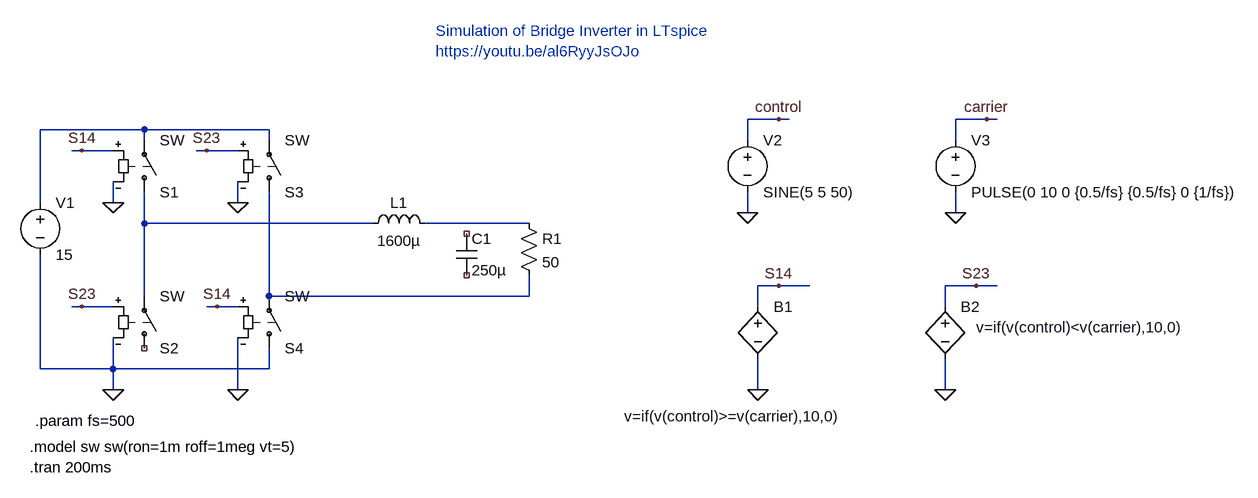
[diagram p0: schematic DC-to-AC-bipolar-full-bridge.asc]
DC-to-AC-bipolar-full-bridge.asc, the LTspice schematic file:
Version 4
SHEET 1 1936 680
WIRE 1152 0 1104 0
WIRE 1168 0 1152 0
WIRE 1472 0 1424 0
WIRE 1488 0 1472 0
WIRE 176 16 16 16
WIRE 368 16 176 16
WIRE 176 32 176 16
WIRE 368 32 368 16
WIRE 1104 32 1104 0
WIRE 1424 32 1424 0
WIRE 80 48 64 48
WIRE 128 48 80 48
WIRE 272 48 256 48
WIRE 320 48 272 48
WIRE 16 128 16 16
WIRE 128 128 128 96
WIRE 320 128 320 96
WIRE 1104 144 1104 112
WIRE 1424 144 1424 112
WIRE 176 160 176 112
WIRE 528 160 176 160
WIRE 768 160 608 160
WIRE 1152 256 1120 256
WIRE 1200 256 1152 256
WIRE 1456 256 1408 256
WIRE 1488 256 1456 256
WIRE 176 272 176 160
WIRE 368 272 368 112
WIRE 768 272 768 240
WIRE 768 272 368 272
WIRE 80 288 64 288
WIRE 128 288 80 288
WIRE 288 288 272 288
WIRE 320 288 288 288
WIRE 1120 288 1120 256
WIRE 1408 288 1408 256
WIRE 16 384 16 208
WIRE 128 384 128 336
WIRE 128 384 16 384
WIRE 368 384 368 352
WIRE 368 384 128 384
WIRE 128 416 128 384
WIRE 320 416 320 336
WIRE 1120 416 1120 368
WIRE 1408 416 1408 368
FLAG 320 128 0
FLAG 128 128 0
FLAG 128 416 0
FLAG 320 416 0
FLAG 80 48 S14
FLAG 288 288 S14
FLAG 272 48 S23
FLAG 80 288 S23
FLAG 1104 144 0
FLAG 1424 144 0
FLAG 1152 0 control
FLAG 1472 0 carrier
FLAG 1120 416 0
FLAG 1408 416 0
FLAG 1152 256 S14
FLAG 1456 256 S23
SYMBOL voltage 16 112 R0
WINDOW 123 0 0 Left 0
WINDOW 39 0 0 Left 0
SYMATTR InstName V1
SYMATTR Value 15
SYMBOL sw 176 128 M180
SYMATTR InstName S1
SYMBOL sw 176 368 M180
SYMATTR InstName S2
SYMBOL sw 368 128 M180
SYMATTR InstName S3
SYMBOL sw 368 368 M180
SYMATTR InstName S4
SYMBOL ind 512 176 R270
WINDOW 0 32 56 VTop 2
WINDOW 3 5 56 VBottom 2
SYMATTR InstName L1
SYMATTR Value 1600µ
SYMATTR SpiceLine Rser=200m
SYMBOL cap 656 176 R0
SYMATTR InstName C1
SYMATTR Value 250µ
SYMATTR SpiceLine Rser=100m
SYMBOL res 752 144 R0
SYMATTR InstName R1
SYMATTR Value 50
SYMBOL voltage 1104 16 R0
WINDOW 123 0 0 Left 0
WINDOW 39 0 0 Left 0
SYMATTR InstName V2
SYMATTR Value SINE(5 5 50)
SYMBOL voltage 1424 16 R0
WINDOW 123 0 0 Left 0
WINDOW 39 0 0 Left 0
SYMATTR InstName V3
SYMATTR Value PULSE(0 10 0 {0.5/fs} {0.5/fs} 0 {1/fs})
SYMBOL bv 1120 272 R0
WINDOW 3 -206 185 Left 2
SYMATTR Value v=if(v(control)>=v(carrier),10,0)
SYMATTR InstName B1
SYMBOL bv 1408 272 R0
WINDOW 3 48 48 Left 2
SYMATTR Value v=if(v(control)<v(carrier),10,0)
SYMATTR InstName B2
TEXT 8 464 Left 2 !.param fs=500
TEXT 0 504 Left 2 !.model sw sw(ron=1m roff=1meg vt=5)\n.tran 200ms
TEXT 624 -136 Left 2 ;Simulation of Bridge Inverter in LTspice\nhttps://youtu.be/al6RyyJsOJo

The netlist it stands for:
* DC-to-AC-bipolar-full-bridge.asc
V1 N001 0 15
S1 N002 N001 S14 0 SW
S2 NC_01 N002 S23 0 SW
S3 N004 N001 S23 0 SW
S4 0 N004 S14 0 SW
L1 N002 N003 1600µ Rser=200m
C1 NC_02 NC_03 250µ Rser=100m
R1 N003 N004 50
V2 control 0 SINE(5 5 50)
V3 carrier 0 PULSE(0 10 0 {0.5/fs} {0.5/fs} 0 {1/fs})
B1 S14 0 v=if(v(control)>=v(carrier),10,0)
B2 S23 0 v=if(v(control)<v(carrier),10,0)
.param fs=500
.model sw sw(ron=1m roff=1meg vt=5)
.tran 200ms
* Simulation of Bridge Inverter in LTspice
* https://youtu.be/al6RyyJsOJo
.backanno
.end